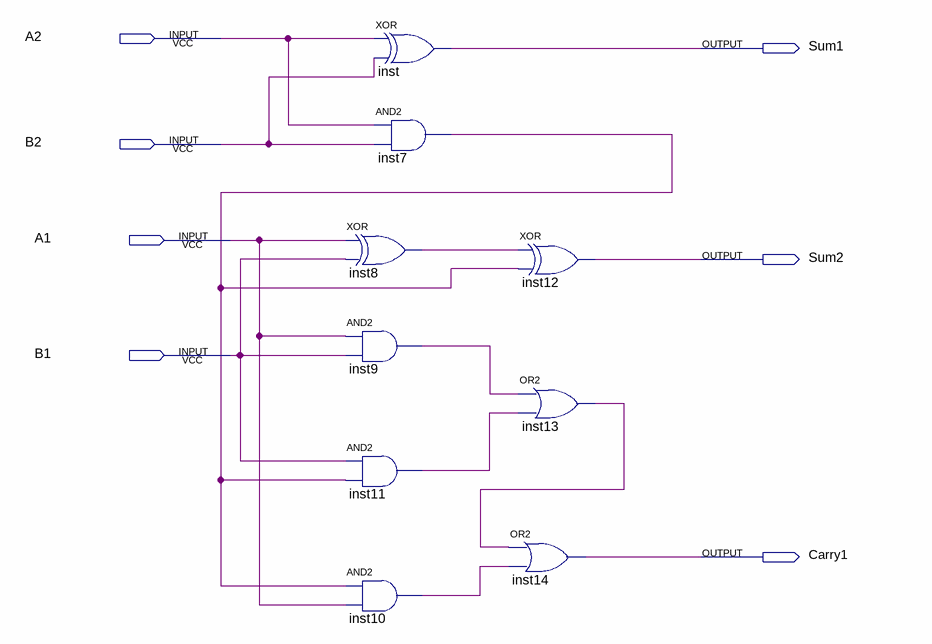
[diagram p0: schematic sheet]
// Quartus schematic fullAdder.bdf as structural Verilog: 9 symbols, 7 pins
module fullAdder (
  input  A2,
  input  B2,
  input  A1,
  input  B1,
  output Sum1,
  output Sum2,
  output Carry1
);

  wire inst7_out, inst8_out, inst9_out, inst10_out, inst11_out, inst13_out;

  xor inst (Sum1, A2, B2);
  and inst7 (inst7_out, A2, B2);
  xor inst8 (inst8_out, A1, B1);
  and inst9 (inst9_out, A1, B1);
  and inst11 (inst11_out, B1, inst7_out);
  and inst10 (inst10_out, inst7_out, A1);
  xor inst12 (Sum2, inst8_out, inst7_out);
  or inst13 (inst13_out, inst9_out, inst11_out);
  or inst14 (Carry1, inst13_out, inst10_out);
endmodule
